# EAGLE design ENGI301_synthesizer (EAGLE 9.5.1)
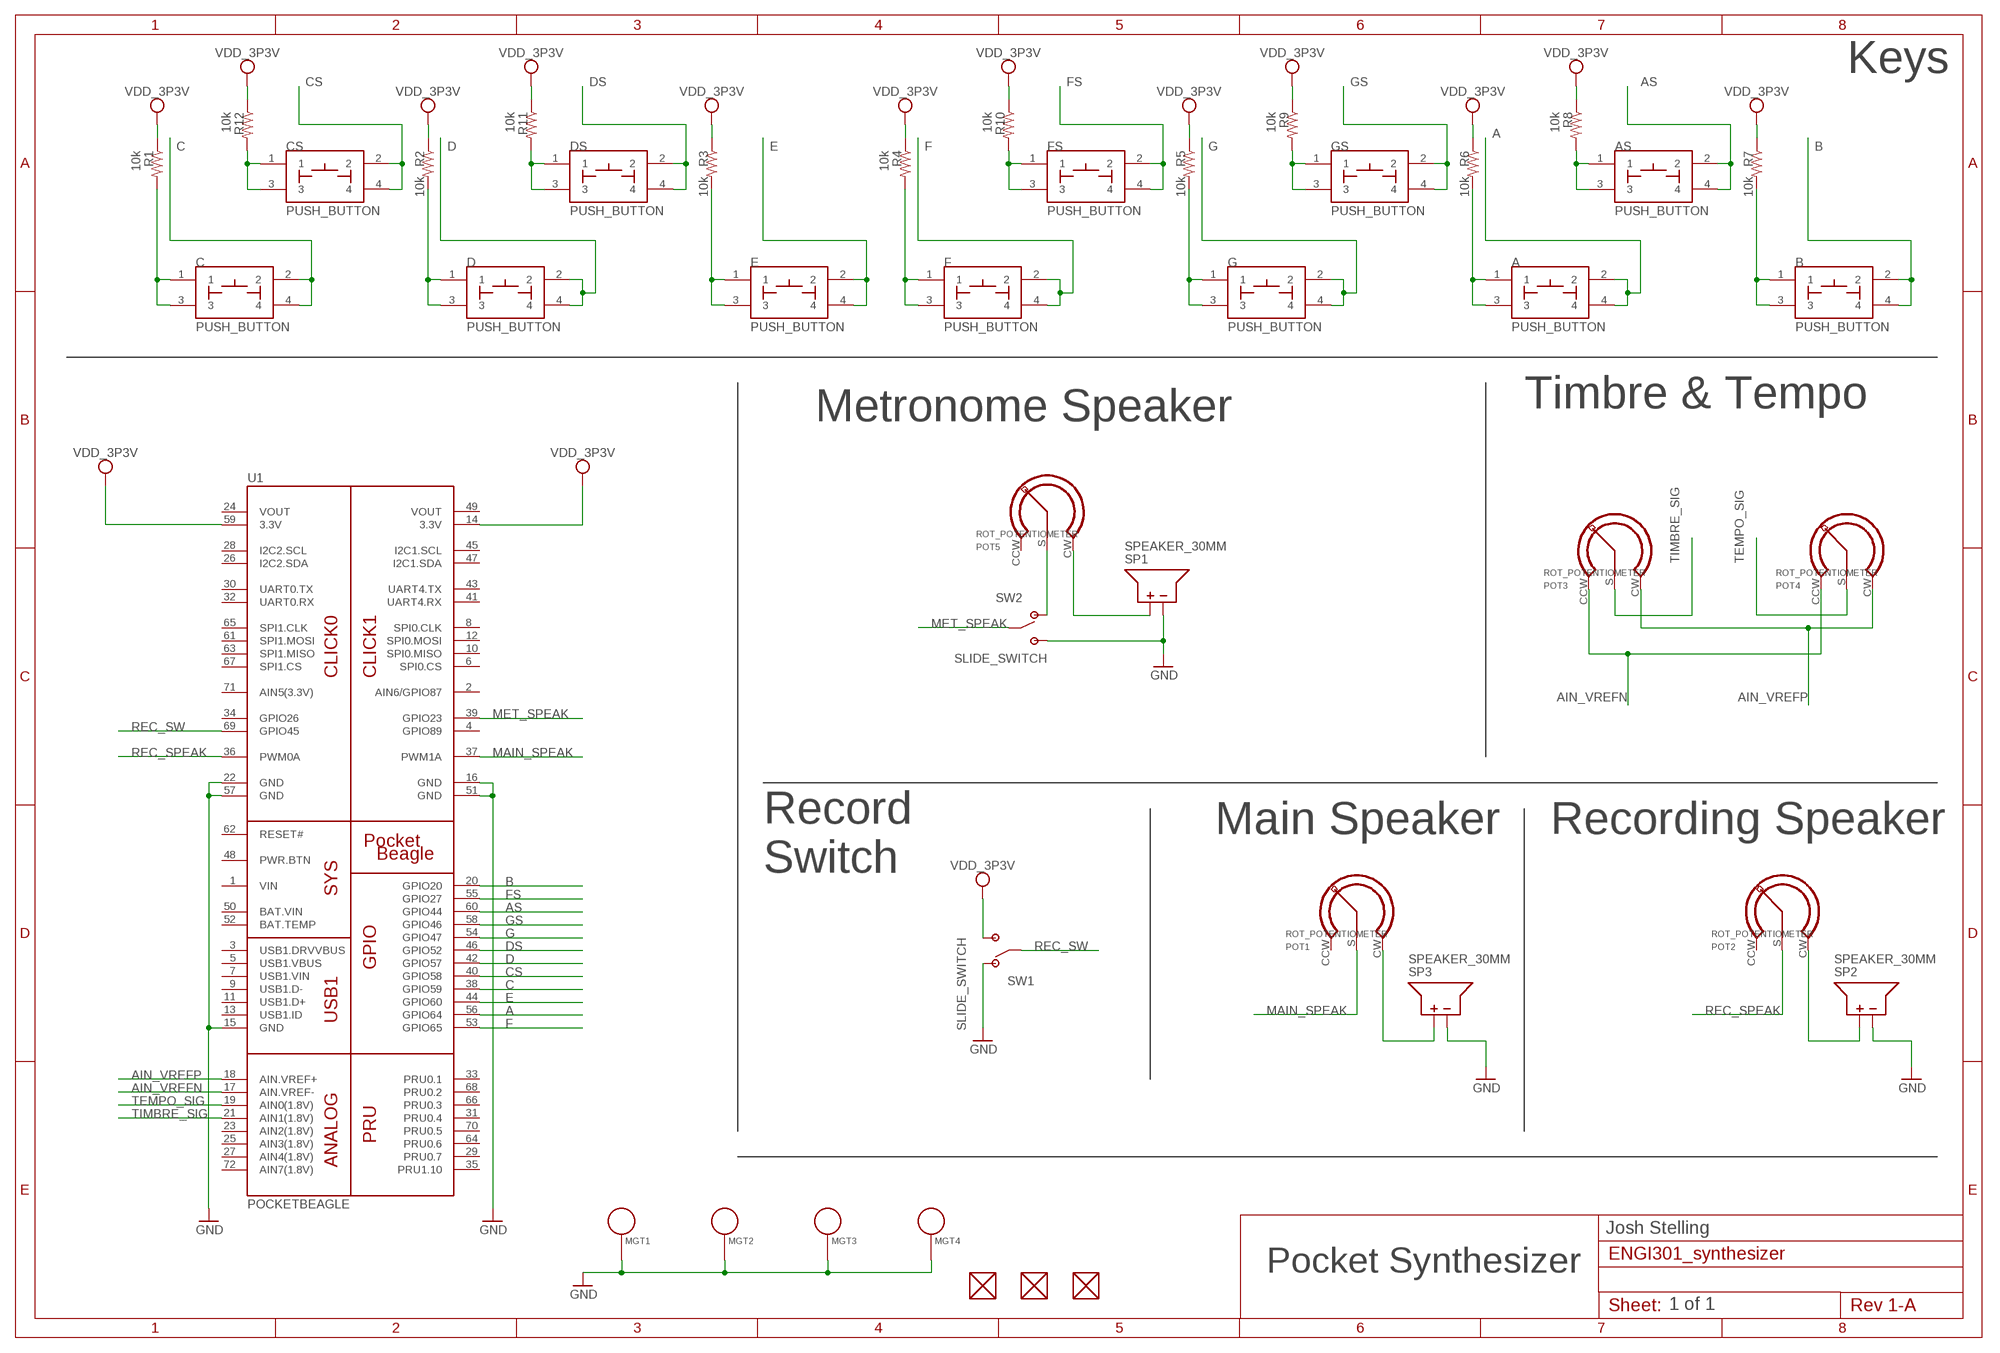
[diagram p0: schematic, sheet 1]

## Parts
A  PUSH_BUTTON  [BUTTON_12.5MM]
AS  PUSH_BUTTON  [BUTTON_12.5MM]
B  PUSH_BUTTON  [BUTTON_12.5MM]
C  PUSH_BUTTON  [BUTTON_12.5MM]
CS  PUSH_BUTTON  [BUTTON_12.5MM]
D  PUSH_BUTTON  [BUTTON_12.5MM]
DS  PUSH_BUTTON  [BUTTON_12.5MM]
E  PUSH_BUTTON  [BUTTON_12.5MM]
F  PUSH_BUTTON  [BUTTON_12.5MM]
FS  PUSH_BUTTON  [BUTTON_12.5MM]
FUD1  FIDUCIAL  [FIDUCIAL_40MIL]
FUD3  FIDUCIAL  [FIDUCIAL_40MIL]
FUD4  FIDUCIAL  [FIDUCIAL_40MIL]
G  PUSH_BUTTON  [BUTTON_12.5MM]
GS  PUSH_BUTTON  [BUTTON_12.5MM]
MGT1  MOUNTING_HOLE  [MOUNTING_HOLE]
MGT2  MOUNTING_HOLE  [MOUNTING_HOLE]
MGT3  MOUNTING_HOLE  [MOUNTING_HOLE]
MGT4  MOUNTING_HOLE  [MOUNTING_HOLE]
POT1  ROT_POTENTIOMETER  [POT-P102]
POT2  ROT_POTENTIOMETER  [POT-P102]
POT3  ROT_POTENTIOMETER  [POT-P102]
POT4  ROT_POTENTIOMETER  [POT-P102]
POT5  ROT_POTENTIOMETER  [POT-P102]
R1  10k  R_R1210  [R1210]
R2  10k  R_R1210  [R1210]
R3  10k  R_R1210  [R1210]
R4  10k  R_R1210  [R1210]
R5  10k  R_R1210  [R1210]
R6  10k  R_R1210  [R1210]
R7  10k  R_R1210  [R1210]
R8  10k  R_R1210  [R1210]
R9  10k  R_R1210  [R1210]
R10  10k  R_R1210  [R1210]
R11  10k  R_R1210  [R1210]
R12  10k  R_R1210  [R1210]
SP1  SPEAKER_30MM  [SPEAKER_30MM]
SP2  SPEAKER_30MM  [SPEAKER_30MM]
SP3  SPEAKER_30MM  [SPEAKER_30MM]
SW1  SLIDE_SWITCH  [JS202011SCQN]
SW2  SLIDE_SWITCH  [JS202011SCQN]
U1  POCKETBEAGLE  [POCKETBEAGLE]

## Nets
A: A.2 A.4 U1.56(GPIO64)
AIN_VREFN: POT3.CCW POT4.CCW U1.17(AIN.VREF-)
AIN_VREFP: POT3.CW POT4.CW U1.18(AIN.VREF+)
AS: AS.2 AS.4 U1.60(GPIO44)
B: B.2 B.4 U1.20(GPIO20)
C: C.2 C.4 U1.38(GPIO59)
CS: CS.2 CS.4 U1.40(GPIO58)
D: D.2 D.4 U1.42(GPIO57)
DS: DS.2 DS.4 U1.46(GPIO52)
E: E.2 E.4 U1.44(GPIO60)
F: F.2 F.4 U1.53(GPIO65)
FS: FS.2 FS.4 U1.55(GPIO27)
G: G.2 G.4 U1.54(GPIO47)
GND: MGT1.P$1 MGT2.P$1 MGT3.P$1 MGT4.P$1 SP1.- SP2.- SP3.- SW1.1(POS1) SW1.4(POS1) SW2.3(POS2) SW2.6(POS2) U1.15(GND) U1.16(GND) U1.22(GND) U1.51(GND) U1.57(GND)
GS: GS.2 GS.4 U1.58(GPIO46)
MAIN_SPEAK: POT1.S(WIPER) U1.37(PWM1A)
MET_SPEAK: SW2.2(COMM) SW2.5(COMM) U1.39(GPIO23)
N$1: C.1 C.3 R1.2
N$2: D.1 D.3 R2.2
N$3: POT5.CW SP1.+
N$4: POT5.S(WIPER) SW2.1(POS1) SW2.4(POS1)
N$5: AS.1 AS.3 R8.2
N$6: POT2.CW SP2.+
N$7: E.1 E.3 R3.2
N$8: F.1 F.3 R4.2
N$9: GS.1 GS.3 R9.2
N$10: POT1.CW SP3.+
N$11: FS.1 FS.3 R10.2
N$12: G.1 G.3 R5.2
N$13: DS.1 DS.3 R11.2
N$14: CS.1 CS.3 R12.2
N$15: A.1 A.3 R6.2
N$18: B.1 B.3 R7.2
REC_SPEAK: POT2.S(WIPER) U1.36(PWM0A)
REC_SW: SW1.2(COMM) SW1.5(COMM) U1.69(GPIO45)
TEMPO_SIG: POT4.S(WIPER) U1.19(AIN0(1.8V))
TIMBRE_SIG: POT3.S(WIPER) U1.21(AIN1(1.8V))
VDD_3P3V: R1.1 R2.1 R3.1 R4.1 R5.1 R6.1 R7.1 R8.1 R9.1 R10.1 R11.1 R12.1 SW1.3(POS2) SW1.6(POS2) U1.14(3.3V) U1.59(3.3V)
Unconnected: FUD1.P$1 FUD3.P$1 FUD4.P$1 POT1.CCW POT2.CCW POT5.CCW U1.2(AIN6/GPIO87) U1.3(USB1.DRVVBUS) U1.4(GPIO89) U1.5(USB1.VBUS) U1.6(SPI0.CS) U1.7(USB1.VIN) U1.8(SPI0.CLK) U1.9(USB1.D-) U1.10(SPI0.MISO) U1.11(USB1.D+) U1.12(SPI0.MOSI) U1.13(USB1.ID) U1.23(AIN2(1.8V)) U1.25(AIN3(1.8V)) U1.26(I2C2.SDA) U1.27(AIN4(1.8V)) U1.28(I2C2.SCL) U1.29(PRU0.7) U1.30(UART0.TX) U1.31(PRU0.4) U1.32(UART0.RX) U1.33(PRU0.1) U1.34(GPIO26) U1.35(PRU1.10) U1.41(UART4.RX) U1.43(UART4.TX) U1.45(I2C1.SCL) U1.47(I2C1.SDA) U1.48(PWR.BTN) U1.52(BAT.TEMP) U1.61(SPI1.MOSI) U1.62(RESET#) U1.63(SPI1.MISO) U1.64(PRU0.6) U1.65(SPI1.CLK) U1.66(PRU0.3) U1.67(SPI1.CS) U1.68(PRU0.2) U1.70(PRU0.5) U1.71(AIN5(3.3V)) U1.72(AIN7(1.8V))

## Notes on the sheet
- Keys
- Metronome Speaker | Timbre & Tempo
- Main Speaker | Recording Speaker
- Record
  Switch
- Josh Stelling
- Pocket Synthesizer
- 1 of 1

## Power pins joined to a net without a drawn wire
BAT.VIN: U1.50(BAT.VIN)
VIN: U1.1(VIN)
VOUT: U1.24(VOUT) U1.49(VOUT)

## Library data of the parts
A AS B C CS D DS E F FS G GS = ENGI301:PUSH_BUTTON
FUD1 FUD3 FUD4 = ENGI301:FIDUCIAL
MGT1-MGT4 = ENGI301:MOUNTING_HOLE: Chassis Mounting Hole w/GND connection ability
POT1-POT5 = ENGI301:ROT_POTENTIOMETER
R1-R12 = ENGI301:R_: RESISTOR, American symbol
SP1-SP3 = ENGI301:SPEAKER_30MM: Breadboard friendly buzzer Adafruit 1898
SW1 SW2 = ENGI301:SLIDE_SWITCH: JS202011SCQN SPDT Slide Switch
U1 = ENGI301:POCKETBEAGLE

## Board
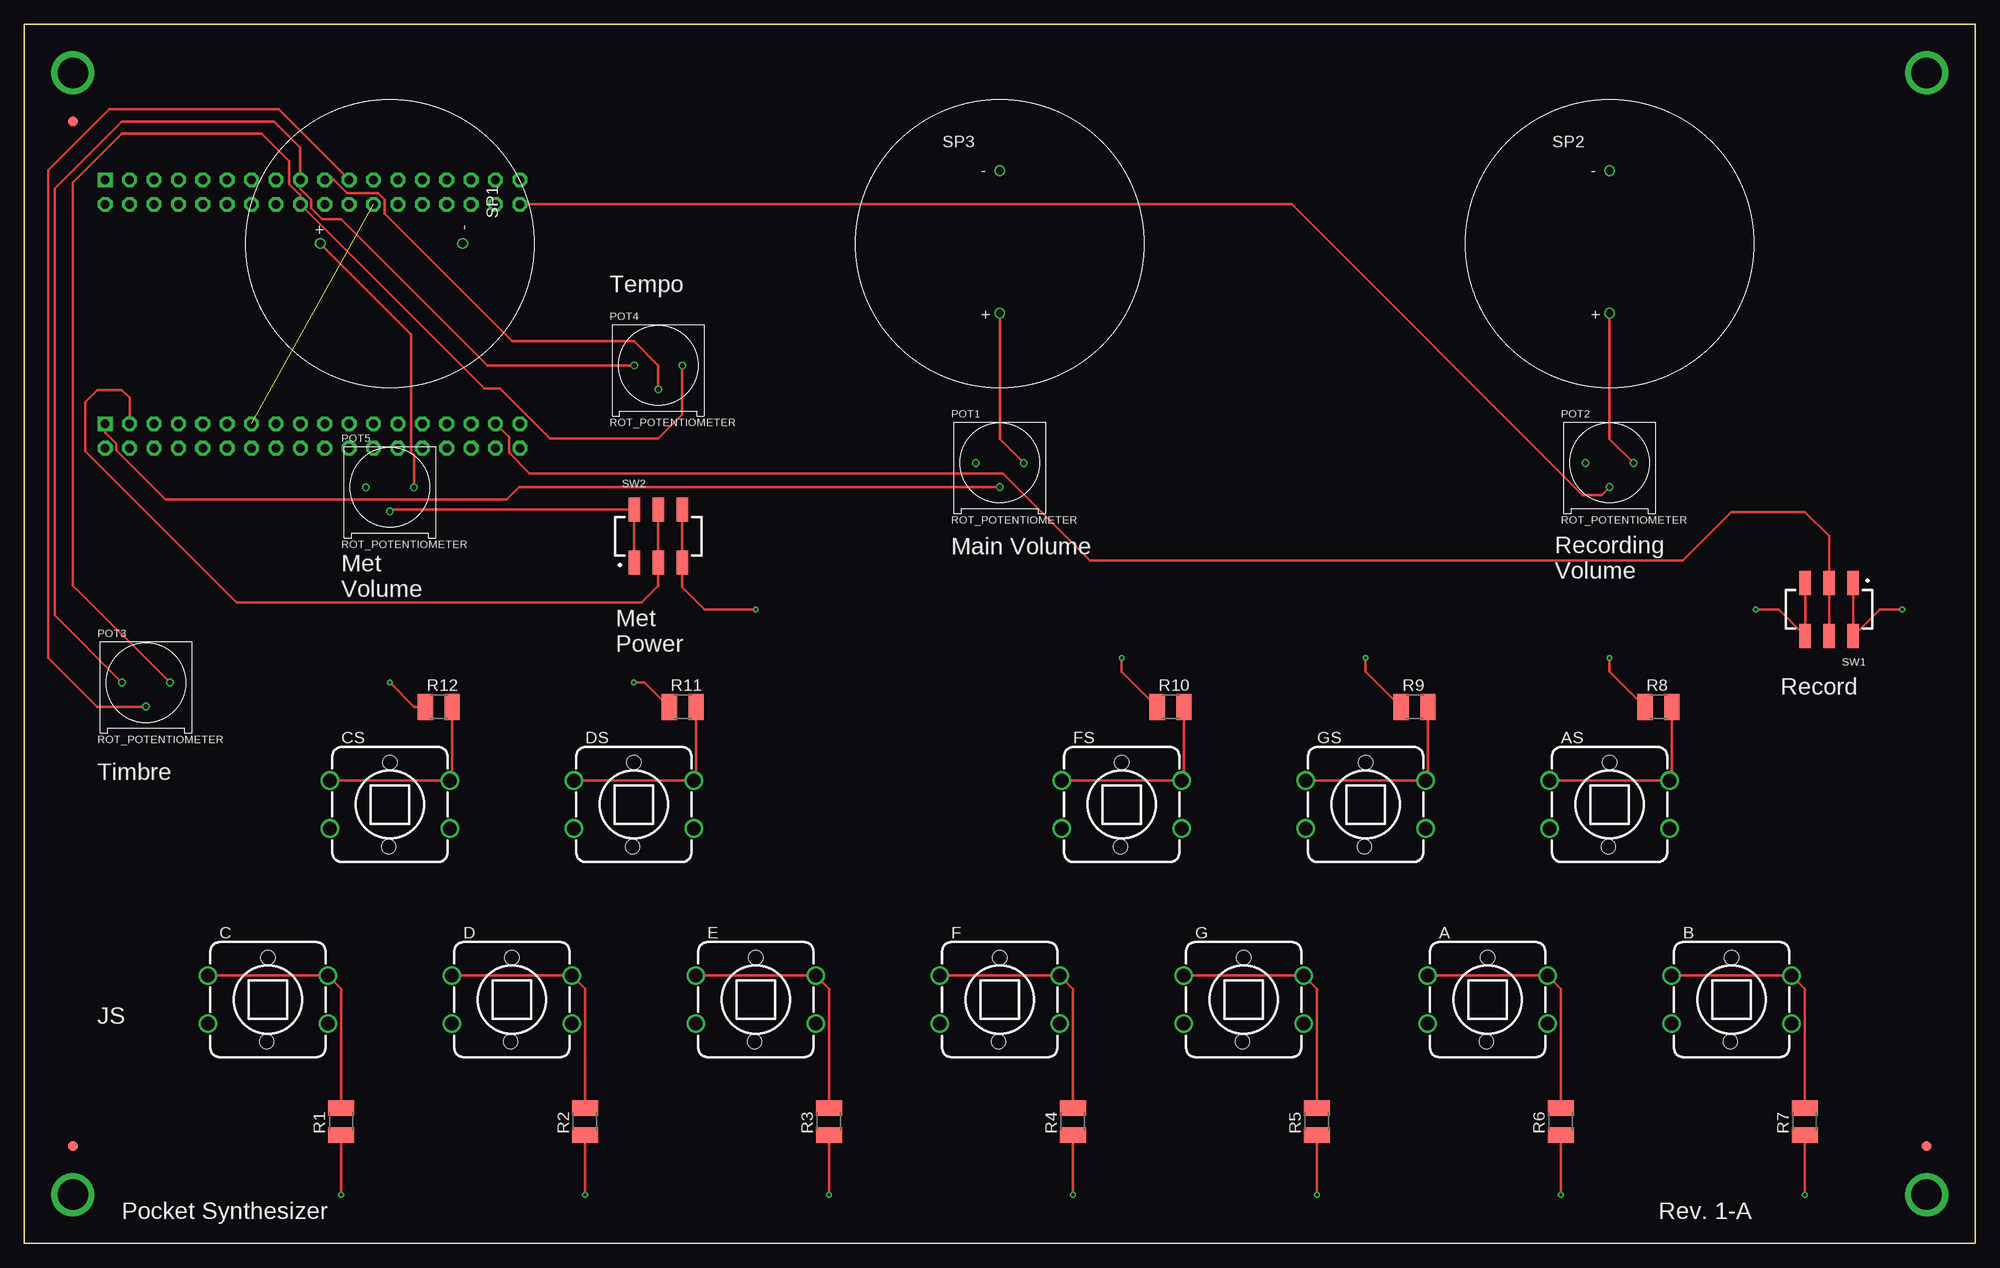
[diagram p1: board, top side]
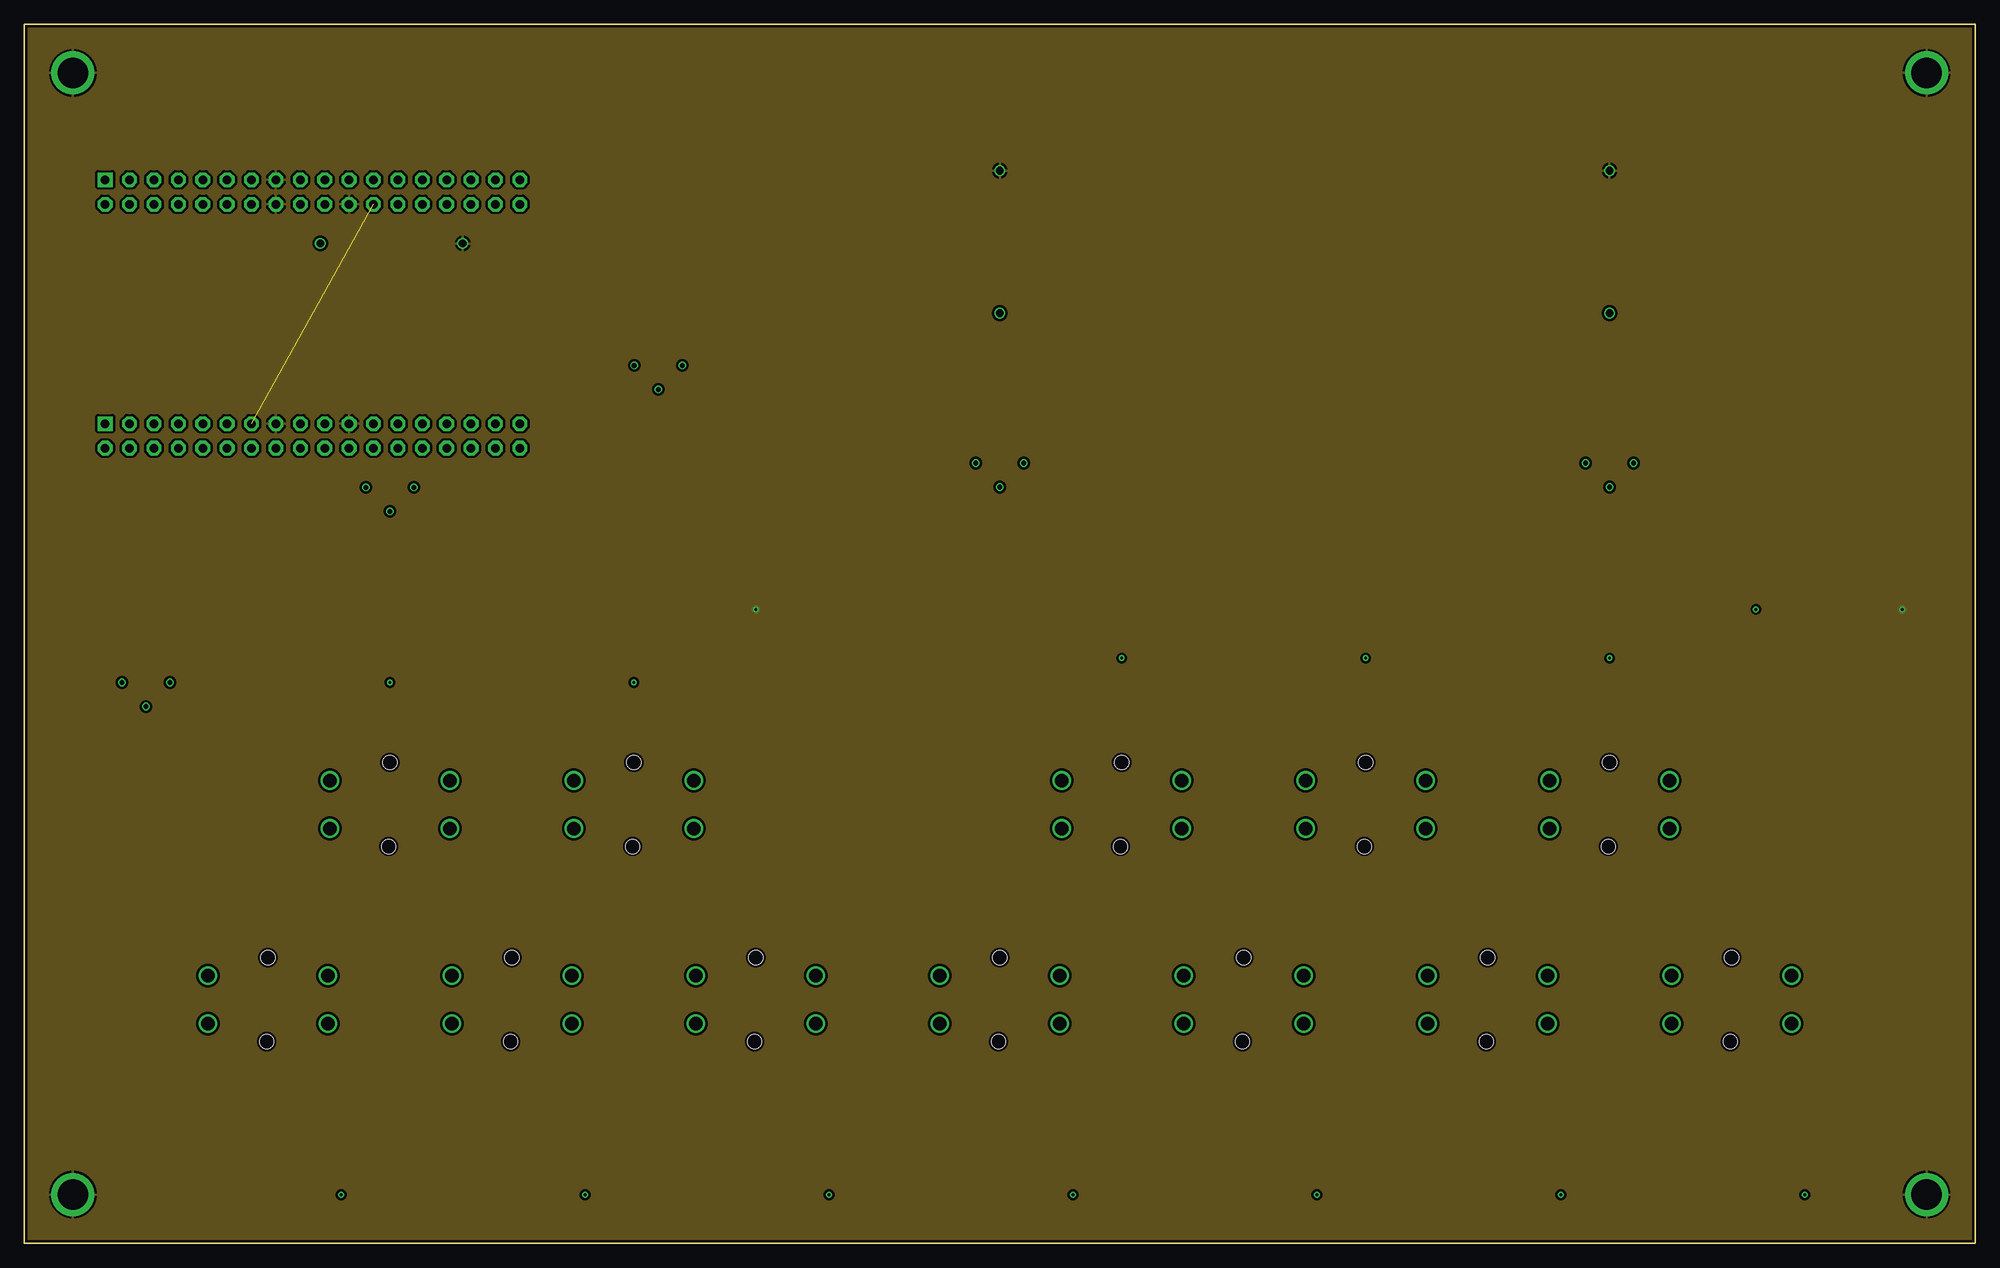
[diagram p2: board, inner layer Route2]
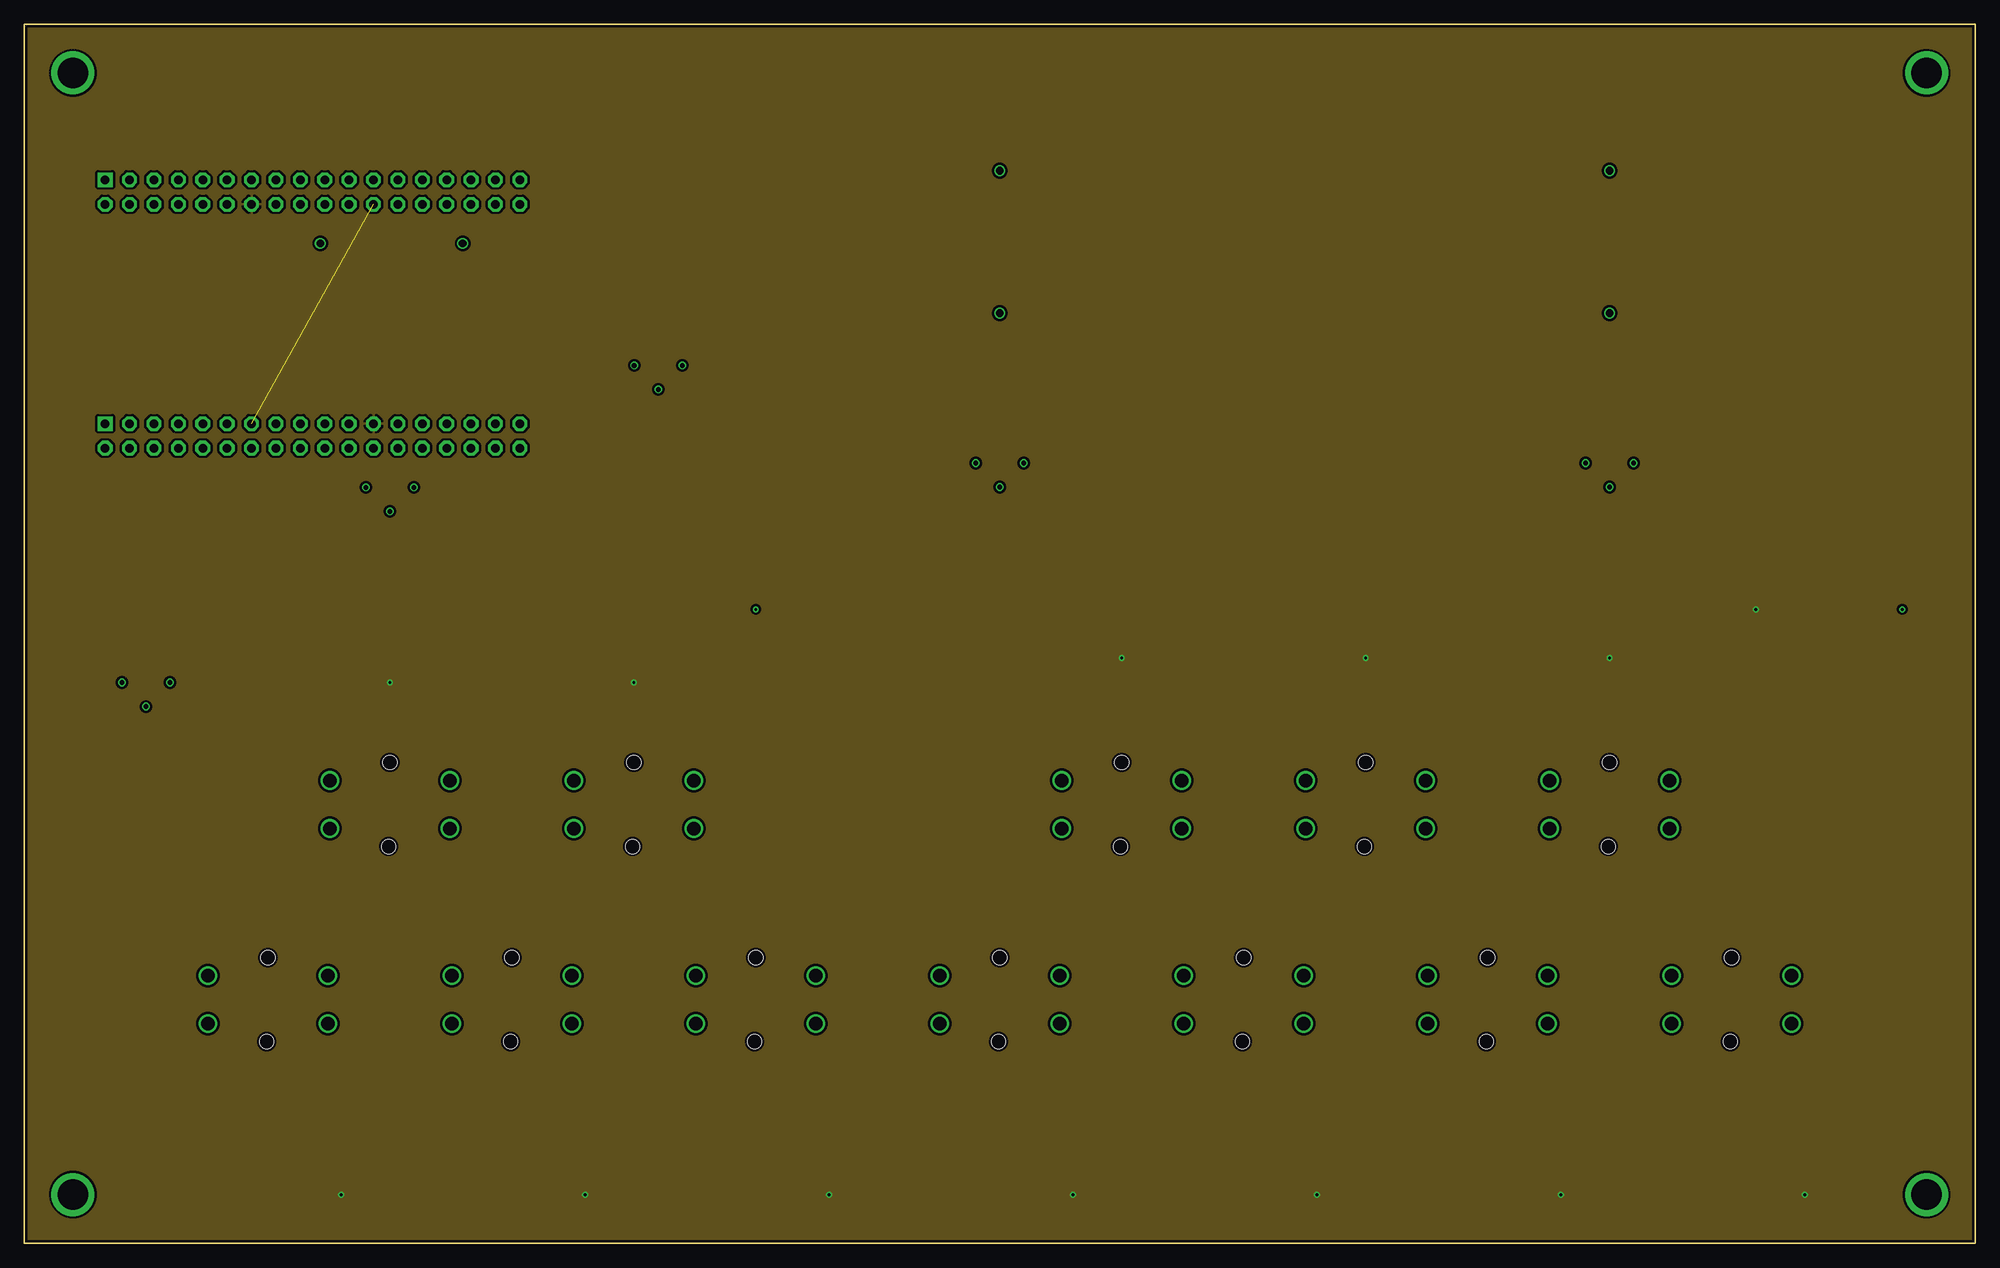
[diagram p3: board, inner layer Route15]
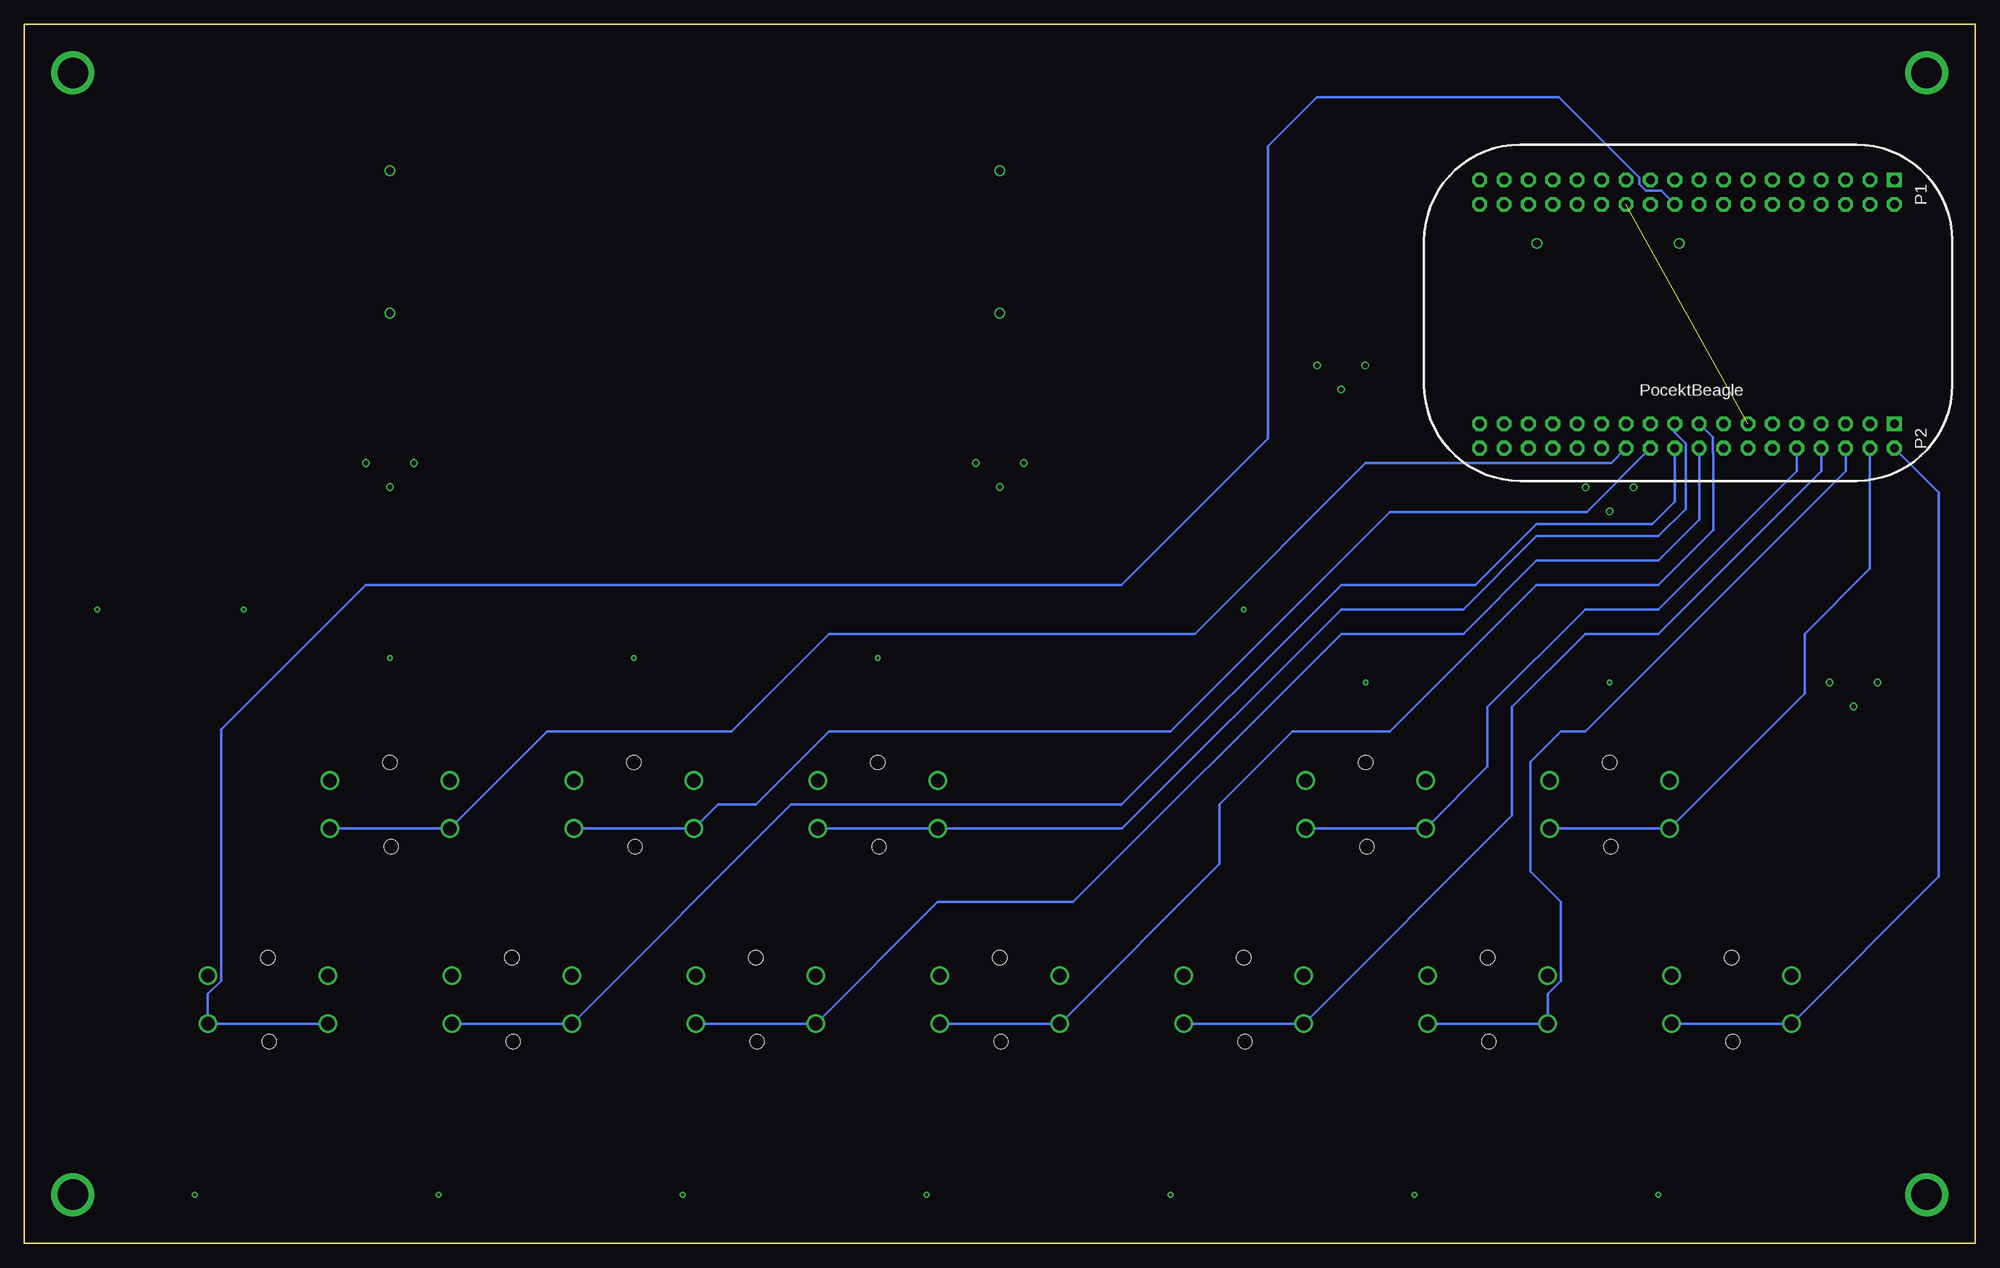
[diagram p4: board, bottom side, seen from below]

Size 203.2 x 127 mm. Coordinates in mm from the lower left corner, seen from the top.
Outline: 0,0 203.2,0 203.2,127 0,127 0,0
Copper layers (1*2*15*16): Top 0.035mm / dielectric 0.23mm / Route2 0.035mm / dielectric 0.93mm / Route15 0.035mm / dielectric 0.23mm / Bottom 0.035mm
Design rules "ENGI301_4lyr": minimum track width 10mil, minimum drill 12mil, track to track 10mil, track to pad 10mil, pad to pad 10mil, via to via 10mil, smd to smd 10mil, copper to edge 10mil, drill to drill 12mil, minimum pad ring 6mil, minimum via ring 6mil, stop-mask expansion 3mil, vias tented up to drill 25mil, thermal gap 10mil

### Footprints (pad centres in the part's own frame; a part is rotated, then mirrored left to right if it is on the bottom)
BUTTON_12.5MM = drill 1.4: 1 -6.25,2.5; 2 -6.25,-2.5; 3 6.25,2.5; 4 6.25,-2.5 | hole 1.5: 0,4.375; -0.125,-4.375
FIDUCIAL_40MIL = smd 1.016 x 1.016: P$1 0,0
MOUNTING_HOLE = drill 3.175 pad 4.445: P$1 0,0
POT-P102 = drill 0.5: CCW -2.5,0; CW 2.5,0; S 0,-2.5
R1210 = smd 1.6 x 2.7: 1 -1.4,0; 2 1.4,0
SPEAKER_30MM = drill 0.8: + 0,-7.25; - 0,7.58
JS202011SCQN = smd 1.2 x 2.5: 1 -2.5,-2.75; 2 0,-2.75; 3 2.5,-2.75; 4 -2.5,2.75; 5 0,2.75; 6 2.5,2.75
POCKETBEAGLE = drill 0.889 pad 1.524 square: 1 5.91,3.53; 37 5.91,28.93 | drill 0.889 pad 1.524 octagon: 2 5.91,6.07; 3 8.45,3.53; 4 8.45,6.07; 5 10.99,3.53; 6 10.99,6.07; 7 13.53,3.53; 8 13.53,6.07; 9 16.07,3.53; 10 16.07,6.07; 11 18.61,3.53; 12 18.61,6.07; 13 21.15,3.53; 14 21.15,6.07; 15 23.69,3.53; 16 23.69,6.07; 17 26.23,3.53; 18 26.23,6.07; 19 28.77,3.53; 20 28.77,6.07; 21 31.31,3.53; 22 31.31,6.07; 23 33.85,3.53; 24 33.85,6.07; 25 36.39,3.53; 26 36.39,6.07; 27 38.93,3.53; 28 38.93,6.07; 29 41.47,3.53; 30 41.47,6.07; 31 44.01,3.53; 32 44.01,6.07; 33 46.55,3.53; 34 46.55,6.07; 35 49.09,3.53; 36 49.09,6.07; 38 5.91,31.47; 39 8.45,28.93; 40 8.45,31.47; 41 10.99,28.93; 42 10.99,31.47; 43 13.53,28.93; 44 13.53,31.47; 45 16.07,28.93; 46 16.07,31.47; 47 18.61,28.93; 48 18.61,31.47; 49 21.15,28.93; 50 21.15,31.47; 51 23.69,28.93; 52 23.69,31.47; 53 26.23,28.93; 54 26.23,31.47; 55 28.77,28.93; 56 28.77,31.47; 57 31.31,28.93; 58 31.31,31.47; 59 33.85,28.93; 60 33.85,31.47; 61 36.39,28.93; 62 36.39,31.47; 63 38.93,28.93; 64 38.93,31.47; 65 41.47,28.93; 66 41.47,31.47; 67 44.01,28.93; 68 44.01,31.47; 69 46.55,28.93; 70 46.55,31.47; 71 49.09,28.93; 72 49.09,31.47

### Placement (x,y rotation side)
A  152.4,25.4 0 top
AS  165.1,45.72 0 top
B  177.8,25.4 0 top
C  25.4,25.4 0 top
CS  38.1,45.72 0 top
D  50.8,25.4 0 top
DS  63.5,45.72 0 top
E  76.2,25.4 0 top
F  101.6,25.4 0 top
FS  114.3,45.72 0 top
FUD1  5.08,10.16 0 top
FUD3  5.08,116.84 0 top
FUD4  198.12,10.16 0 top
G  127,25.4 0 top
GS  139.7,45.72 0 top
MGT1  5.08,5.08 0 top
MGT2  5.08,121.92 0 top
MGT3  198.12,5.08 0 top
MGT4  198.12,121.92 0 top
POT1  101.6,81.28 0 top
POT2  165.1,81.28 0 top
POT3  12.7,58.42 0 top
POT4  66.04,91.44 0 top
POT5  38.1,78.74 0 top
R1  33.02,12.7 90 top
R2  58.42,12.7 90 top
R3  83.82,12.7 90 top
R4  109.22,12.7 90 top
R5  134.62,12.7 90 top
R6  160.02,12.7 90 top
R7  185.42,12.7 90 top
R8  170.18,55.88 0 top
R9  144.78,55.88 0 top
R10  119.38,55.88 0 top
R11  68.58,55.88 0 top
R12  43.18,55.88 0 top
SP1  38.1,104.14 270 top
SP2  165.1,104.14 0 top
SP3  101.6,104.14 0 top
SW1  187.96,66.04 180 top
SW2  66.04,73.66 0 top
U1  2.54,114.3 180 bottom

### Tracks (layer width: path | path; a pad name or v marks a point on that pad's centre or on a via)
A
  Bottom 0.254: A.4 A.2 123.33,45.72 88.9,45.72 66.04,68.58 52.07,68.58 45.72,74.93 33.66,74.93 31.31,77.28 U1.56
AIN_VREFN
  Top 0.254: POT3.CCW 3.17,65.44 3.17,109.86 10.16,116.84 26.04,116.84 28.77,114.11 U1.17 28.77,109.87 29.91,108.73 29.91,107.81 31.04,106.68 33.02,106.68 48.26,91.44 POT4.CCW
AIN_VREFP
  Top 0.254: POT4.CW 68.54,86.32 66.04,83.82 54.8,83.82 49.56,89.05 47.95,89.05 U1.18 28.77,109.15 27.63,110.3 27.63,112.71 24.77,115.57 10.16,115.57 5.08,110.49 5.08,68.54 POT3.CW
AS
  Bottom 0.254: AS.4 AS.2 148.73,53.34 129.54,53.34 119.38,63.5 81.28,63.5 63.5,81.28 37.94,81.28 U1.60
B
  Bottom 0.254: B.2 B.4 184.05,25.98 182.69,27.34 182.69,53.53 167.64,68.58 88.9,68.58 73.66,83.82 73.66,114.3 68.58,119.38 43.38,119.38 34.99,110.99 34.99,110.3 34.32,109.63 32.71,109.63 U1.20
C
  Bottom 0.254: C.4 C.2 3.81,38.24 3.81,78.19 U1.38
CS
  Bottom 0.254: CS.4 CS.2 17.78,57.29 17.78,63.5 10.99,70.29 U1.40
D
  Bottom 0.254: D.4 D.2 44.55,25.98 43.19,27.34 43.19,35.57 46.35,38.73 46.35,50.16 43.18,53.34 40.64,53.34 13.53,80.45 U1.42
DS
  Bottom 0.254: DS.4 DS.2 50.8,49.67 50.8,55.88 40.64,66.04 33.02,66.04 18.61,80.45 U1.46
E
  Bottom 0.254: E.4 E.2 48.26,44.59 48.26,55.88 40.64,63.5 33.02,63.5 16.07,80.45 U1.44
F
  Bottom 0.254: F.4 F.2 78.74,39.51 78.74,45.72 71.12,53.34 60.96,53.34 45.72,68.58 33.02,68.58 27.3,74.3 27.3,82.29 27.37,82.36 27.37,83.97 U1.53
FS
  Bottom 0.254: FS.4 FS.2 88.86,43.22 66.04,66.04 53.34,66.04 45.72,73.66 33.02,73.66 30.17,76.51 30.17,83.3 31.31,84.45 U1.55
G
  Bottom 0.254: G.4 G.2 108.09,35.56 93.98,35.56 66.04,63.5 53.34,63.5 45.72,71.12 33.02,71.12 28.77,75.37 U1.54
GND  (via drill 0.3 pad 0.61)
  Top 0.254: SW1.1 SW1.4 193.21,66.04 v195.58,66.04 | SW2.6 SW2.3 68.54,68.37 70.87,66.04 v76.2,66.04
  pour Route2: -2.54,129.54 -2.54,-2.54 205.74,-2.54 205.74,129.54
GS
  Bottom 0.254: GS.4 GS.2 130.95,45.72 127,45.72 119.38,53.34 83.82,53.34 60.96,76.2 40.48,76.2 U1.58
MAIN_SPEAK
  Top 0.254: POT1.S 51.56,78.78 50.25,77.47 14.73,77.47 9.59,82.61 9.59,83.3 8.45,84.45 U1.37
MET_SPEAK
  Top 0.254: SW2.5 SW2.2 66.04,68.48 64.3,66.74 22.16,66.74 6.35,82.55 6.35,87.63 7.62,88.9 10.16,88.9 10.99,88.07 U1.39
N$1
  Top 0.254: C.1 C.3 33.02,26.53 R1.2
N$2
  Top 0.254: D.1 D.3 58.42,26.53 R2.2
N$3
  Top 0.254: POT5.CW 40.6,82.08 40.33,82.36 40.33,94.66 SP1.+
N$4
  Top 0.254: SW2.1 SW2.4 38.27,76.41 POT5.S
N$5
  Top 0.254: AS.1 AS.3 171.58,48.45 R8.2
N$6
  Top 0.254: POT2.CW 165.1,83.78 SP2.+
N$7
  Top 0.254: E.1 E.3 83.82,26.53 R3.2
N$8
  Top 0.254: F.1 F.3 109.22,26.53 R4.2
N$9
  Top 0.254: GS.1 GS.3 146.18,48.45 R9.2
N$10
  Top 0.254: POT1.CW 101.6,83.78 SP3.+
N$11
  Top 0.254: FS.1 FS.3 120.78,48.45 R10.2
N$12
  Top 0.254: G.1 G.3 134.62,26.53 R5.2
N$13
  Top 0.254: R11.2 69.98,48.45 DS.3 DS.1
N$14
  Top 0.254: CS.1 CS.3 44.58,48.45 R12.2
N$15
  Top 0.254: A.1 A.3 160.02,26.53 R6.2
N$18
  Top 0.254: B.1 B.3 185.42,26.53 R7.2
REC_SPEAK
  Top 0.254: U1.36 132,108.23 162.28,77.96 164.32,77.96 165.1,78.74 POT2.S
REC_SW
  Top 0.254: SW1.5 SW1.2 187.96,73.66 185.42,76.2 177.8,76.2 172.72,71.12 111,71.12 101.92,80.2 52.65,80.2 50.49,82.36 50.49,83.97 U1.69
TEMPO_SIG
  Top 0.254: U1.19 32.23,110.77 33.63,109.37 36.86,109.37 37.53,108.7 37.53,107.25 50.8,93.98 63.5,93.98 66.04,91.44 POT4.S
TIMBRE_SIG
  Top 0.254: POT3.S 12.66,55.88 7.62,55.88 2.54,60.96 2.54,111.76 8.89,118.11 26.51,118.11 U1.21
VDD_3P3V  (via drill 0.3 pad 0.61)
  Top 0.254: R1.1 v33.02,5.08 | R2.1 v58.42,5.08 | v83.82,5.08 R3.1 | v109.22,5.08 R4.1 | R5.1 v134.62,5.08 | R6.1 v160.02,5.08 | R7.1 v185.42,5.08 | R8.1 165.1,59.56 v165.1,60.96 | R9.1 139.7,59.56 v139.7,60.96 | R10.1 114.3,59.56 v114.3,60.96 | v63.5,58.42 64.64,58.42 R11.1 | R12.1 40.64,55.88 v38.1,58.42 | SW1.3 SW1.6 182.71,66.04 v180.34,66.04
  pour Route15: -5.08,132.08 -5.08,-5.08 208.28,-5.08 208.28,132.08
VOUT  (1 unrouted)

### Text on the board
tPlace: Tempo | Main Volume | Recording / Volume | Met / Volume | Met / Power | Record | Timbre | JS | Pocket Synthesizer | Rev. 1-A